# Altium schematic sheet BLUETOOTH.SchDoc
size A4
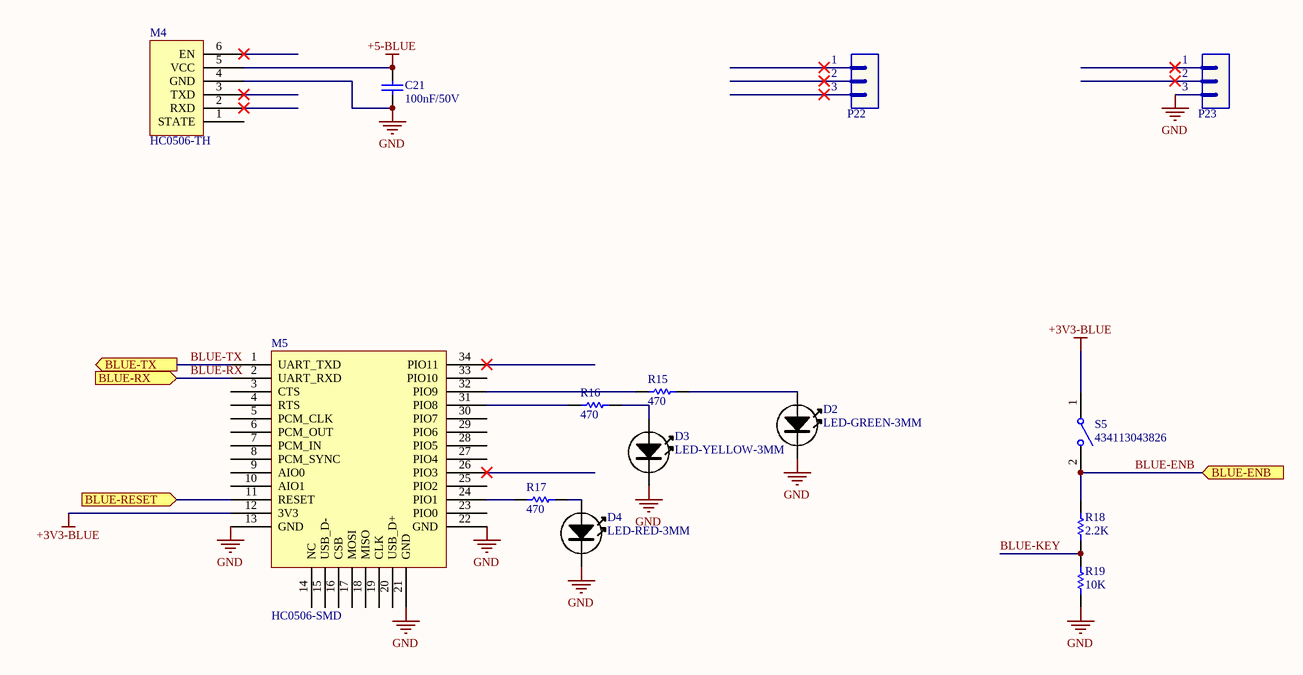
[diagram p0: BLUETOOTH.SchDoc]

## Parts
C21  value 100nF/50V  [CAP-SM-0805]  (hidden comment: Cap-100nF-50V-0805)
D2  LED-GREEN-3MM  [LED-3MM-GREEN]
D3  LED-YELLOW-3MM  [LED-3MM-YELLOW]
D4  LED-RED-3MM  [LED-3MM-RED]
M4  HC0506-TH
M5  HC0506-SMD
P22  Header 3  [JP3]  (value not drawn)
P23  Header 3  [JP3]  (value not drawn)
R15  value 470  [RES-SM-0805]  (hidden comment: Res-470-0805)
R16  value 470  [RES-SM-0805]  (hidden comment: Res-470-0805)
R17  value 470  [RES-SM-0805]  (hidden comment: Res-470-0805)
R18  value 2.2K  [RES-SM-0805]  (hidden comment: Res-2.2K-0805)
R19  value 10K  [RES-SM-0805]  (hidden comment: Res-10k-0805)
S5  434113043826  [434113043826]

## Ports
BLUE-ENB (in), BLUE-RESET (in), BLUE-RX (in), BLUE-TX (out)

## Nets
+3V3-BLUE: M5.12(3V3) S5.1
+5-BLUE: C21.2 M4.5(VCC)
GND: C21.1 D2.K D3.K D4.K M4.4(GND) M5.13(GND) M5.21(GND) M5.22(GND) P23.3 R19.1
BLUE-ENB: R18.2 S5.2 ; port BLUE-ENB
BLUE-KEY: R18.1 R19.2
BLUE-RESET: M5.11(RESET) ; port BLUE-RESET
BLUE-RX: M5.2(UART_RXD) ; port BLUE-RX
BLUE-TX: M5.1(UART_TXD) ; port BLUE-TX
NetD2_A: D2.A R15.2
NetD3_A: D3.A R16.2
NetD4_A: D4.A R17.2
NetM5_24: M5.24(PIO1) R17.1
NetM5_31: M5.31(PIO8) R16.1
NetM5_32: M5.32(PIO9) R15.1

Not connected (* = marked no-connect by the designer): M4 1(STATE) 2(RXD)* 3(TXD)* 6(EN)*; M5 3(CTS) 4(RTS) 5(PCM_CLK) 6(PCM_OUT) 7(PCM_IN) 8(PCM_SYNC) 9(AIO0) 10(AIO1) 14(NC) 15(USB_D-) 16(CSB) 17(MOSI) 18(MISO) 19(CLK) 20(USB_D+) 23(PIO0) 25(PIO2) 26(PIO3)* 27(PIO4) 28(PIO5) 29(PIO6) 30(PIO7) 33(PIO10) 34(PIO11)*; P22 1* 2* 3*; P23 1* 2*

## Library data of the parts
C21 = Cap-100nF-50V-0805: CAP CER 0.1UF 50V Y5V 0805; Manufacturer: Samsung Electro-Mechanics; Manufacturer Part Number: CL21F104ZBCNNNC; Local Supplier: thegioiic; Local Supplier Link: https://thegioiic.com/products/tu-100nf-0-1uf-50v-0805; Supplier 1: Digikey; Supplier 1 Part Number: 1276-1007-1-ND; Supplier 1 Link: https://www.digikey.com/product-detail/en/samsung-electro-mechanics/CL21F104ZBCNNNC/1276-1007-1-ND/3889093
P22 P23 = Header 3: Header, 3-Pin; LatestRevisionDate: 17-Jul-2002; LatestRevisionNote: Re-released for DXP Platform.; Publisher: Altium Limited
R15-R17 = Res-470-0805: RES 470 OHM JUMPER 0805; Manufacturer: YAG6006CT-ND; Manufacturer Part Number: PE0805FRF7W0R047L; Local Supplier: thegioiic; Local Supplier Link: https://www.thegioiic.com/products/dien-tro-470-kohm-0805-5; Supplier 1: Digikey; Supplier 1 Link: https://www.digikey.com/product-detail/en/yageo/PE0805FRF7W0R047L/YAG6006CT-ND/9696460; Supplier 1 Part Number: YAG6006CT-ND
R18 = Res-2.2K-0805: RES SMD 2.2K OHM 1% 1/8W 0805; Manufacturer: TE Connectivity Passive Product; Manufacturer Part Number: CRG0805F2K2; Local Supplier: thegioiic; Local Supplier Link: https://thegioiic.com/products/dien-tro-2-2k-ohm-0805-5; Supplier 1: Digikey; Supplier 1 Link: https://www.digikey.com/product-detail/en/te-connectivity-passive-product/CRG0805F2K2/A106060CT-ND/3477706; Supplier 1 Part Number: A106060CT-ND
R19 = Res-10k-0805: RES 10K OHM 1% 1/4W 0805; Manufacturer: Stackpole Electronics Inc; Manufacturer Part Number: RNCP0805FTD10K0; Local Supplier: thegioiic; Local Supplier Link: https://thegioiic.com/products/dien-tro-10k-ohm-0805-5; Supplier 1: Digikey; Supplier 1 Link: https://www.digikey.com/product-detail/en/stackpole-electronics-inc/RNCP0805FTD10K0/RNCP0805FTD10K0CT-ND/2240601; Supplier 1 Part Number: RNCP0805FTD10K0CT-ND
S5 = 434113043826: WS-TASV J-Bend SMT Tact Switch 6x3.5mm, height 4.3mm, 260gf; Rated Voltage: 12VDC; Rated Current: 50mA; Washable: No; ComponentLink1Description: Manufacturer; ComponentLink1URL: http://www.we-online.de; ComponentLink2Description: Datasheet; ComponentLink2URL: https://katalog.we-online.com/em/datasheet/434113043826.pdf; Operating Temperature: -40 to +85degC; Part Number: 434113043826; Published Date: September 2019; Contact Material: Stainless Steel; Height: 4.3mm; Mounting Technology: SMT; Contact Plating: Silver; Operation Force: 260gf; Packaging: Tape and Reel; Terminal Material: Copper Alloy; Publisher: Wurth Elektronik; Terminal Plating: Silver